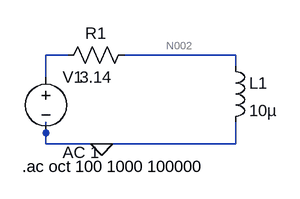
[diagram p0: schematic Draft16.asc]
Draft16.asc, the LTspice schematic file:
Version 4
SHEET 1 880 680
WIRE 0 80 -32 80
WIRE 240 80 80 80
WIRE 240 96 240 80
WIRE -32 112 -32 80
WIRE -32 192 -32 176
WIRE -32 208 -32 192
WIRE 48 208 -32 208
WIRE 240 208 240 176
WIRE 240 208 48 208
FLAG 48 208 0
SYMBOL res 96 64 R90
WINDOW 0 0 56 VBottom 2
WINDOW 3 32 56 VTop 2
SYMATTR InstName R1
SYMATTR Value 3.14
SYMBOL ind 224 80 R0
SYMATTR InstName L1
SYMATTR Value 10µ
SYMBOL voltage -32 96 R0
WINDOW 123 24 124 Left 2
WINDOW 39 0 0 Left 2
SYMATTR InstName V1
SYMATTR Value ""
SYMATTR Value2 AC 1
TEXT -66 240 Left 2 !.ac oct 100 1000 100000

The netlist it stands for:
* Draft16.asc
R1 N002 N001 3.14
L1 N002 0 10µ
V1 N001 0 AC 1
.ac oct 100 1000 100000
.backanno
.end

* Results of the author's LTspice run, read from the files saved beside the schematic
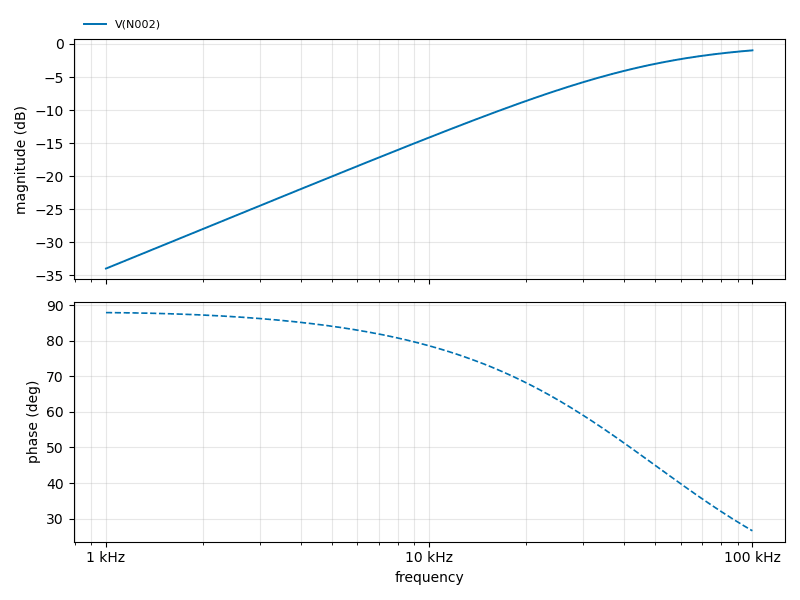
[diagram p1: AC Analysis of Draft16.asc, plotted from the saved traces]
* AC Analysis, 1 run:
*   V(N002): -33.98 dB at 1 kHz, -0.97 dB at 100 kHz, peak -0.97 dB at 100 kHz, 3 dB below the peak at 40.82 kHz